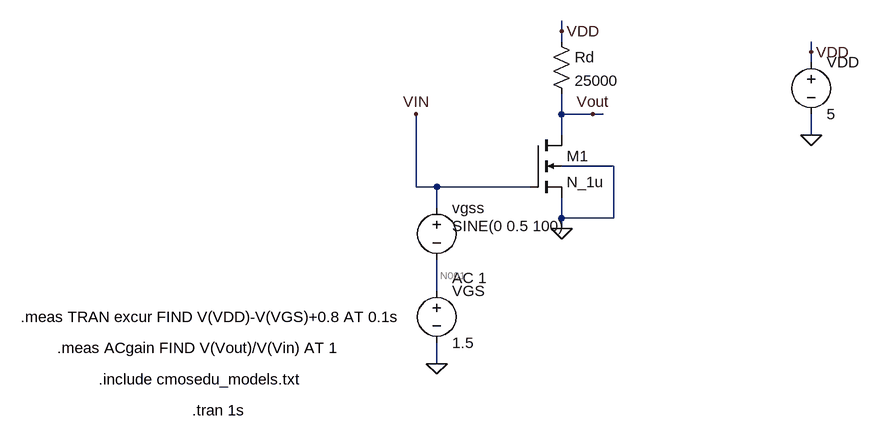
[diagram p0: schematic circuitTRAN.asc]
circuitTRAN.asc, the LTspice schematic file:
Version 4
SHEET 1 1008 680
WIRE 224 -64 224 -80
WIRE 224 -48 224 -64
WIRE 608 -32 608 -48
WIRE 608 -16 608 -32
WIRE 224 64 224 32
WIRE 272 64 224 64
WIRE 288 64 272 64
WIRE 224 96 224 64
WIRE 608 96 608 64
WIRE 304 144 224 144
WIRE 0 176 0 64
WIRE 32 176 0 176
WIRE 176 176 32 176
WIRE 32 208 32 176
WIRE 224 224 224 192
WIRE 304 224 304 144
WIRE 304 224 224 224
WIRE 224 240 224 224
WIRE 32 336 32 288
WIRE 32 448 32 416
FLAG 224 -64 VDD
FLAG 608 96 0
FLAG 224 240 0
FLAG 32 448 0
FLAG 272 64 Vout
FLAG 608 -32 VDD
FLAG 0 64 VIN
SYMBOL nmos4 176 96 R0
SYMATTR InstName M1
SYMATTR Value N_1u
SYMATTR Value2 l=1.5u w=3u
SYMBOL res 208 -64 R0
SYMATTR InstName Rd
SYMATTR Value 25000
SYMBOL voltage 608 -32 R0
SYMATTR InstName VDD
SYMATTR Value 5
SYMBOL voltage 32 192 R0
WINDOW 123 24 124 Left 2
WINDOW 39 0 0 Left 2
WINDOW 3 24 44 Left 2
SYMATTR Value2 AC 1
SYMATTR InstName vgss
SYMATTR Value SINE(0 0.5 100)
SYMBOL voltage 32 320 R0
SYMATTR InstName VGS
SYMATTR Value 1.5
TEXT -488 472 Left 2 !.include cmosedu_models.txt
TEXT -552 424 Left 2 !.meas ACgain FIND V(Vout)/V(Vin) AT 1
TEXT -608 376 Left 2 !.meas TRAN excur FIND V(VDD)-V(VGS)+0.8 AT 0.1s
TEXT -344 520 Left 2 !.tran 1s

The netlist it stands for:
* circuitTRAN.asc
M1 Vout VIN 0 0 N_1u l=1.5u w=3u
Rd VDD Vout 25000
VDD VDD 0 5
vgss VIN N001 SINE(0 0.5 100) AC 1
VGS N001 0 1.5
.model NMOS NMOS
.model PMOS PMOS
.lib standard.mos
.include cmosedu_models.txt
.meas ACgain FIND V(Vout)/V(Vin) AT 1
.meas TRAN excur FIND V(VDD)-V(VGS)+0.8 AT 0.1s
.tran 1s
.backanno
.end

* Results of the author's LTspice run, read from the files saved beside the schematic
* Operating Point, zero values left out:
*   V(vout) = 3.975 V
*   V(vin) = 1.5 V
*   V(vdd) = 5 V
*   V(n001) = 1.5 V
*   Id(M1) = 41.01 µA
*   Ib(M1) = -3.985 pA
*   Is(M1) = -41.01 µA
*   I(Rd) = 41.01 µA
*   I(Vdd) = -41.01 µA
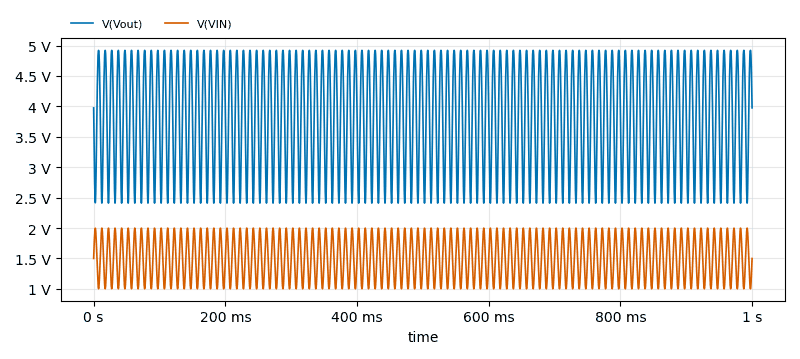
[diagram p1: Transient Analysis of circuitTRAN.asc, plotted from the saved traces]
* Transient Analysis, 1 run:
*   V(Vout): min 2.409 V, max 4.92 V, average 3.802 V, rms 3.908 V, last 3.975 V
*   V(VIN): min 1.001 V, max 1.999 V, average 1.5 V, rms 1.541 V, last 1.5 V
* From the log:
*   acgain: v(vout)/v(vin)=2.64996 at 1
*   Measurement "excur" FAIL'ed